# Altium schematic sheet USB charger.SchDoc
size A4
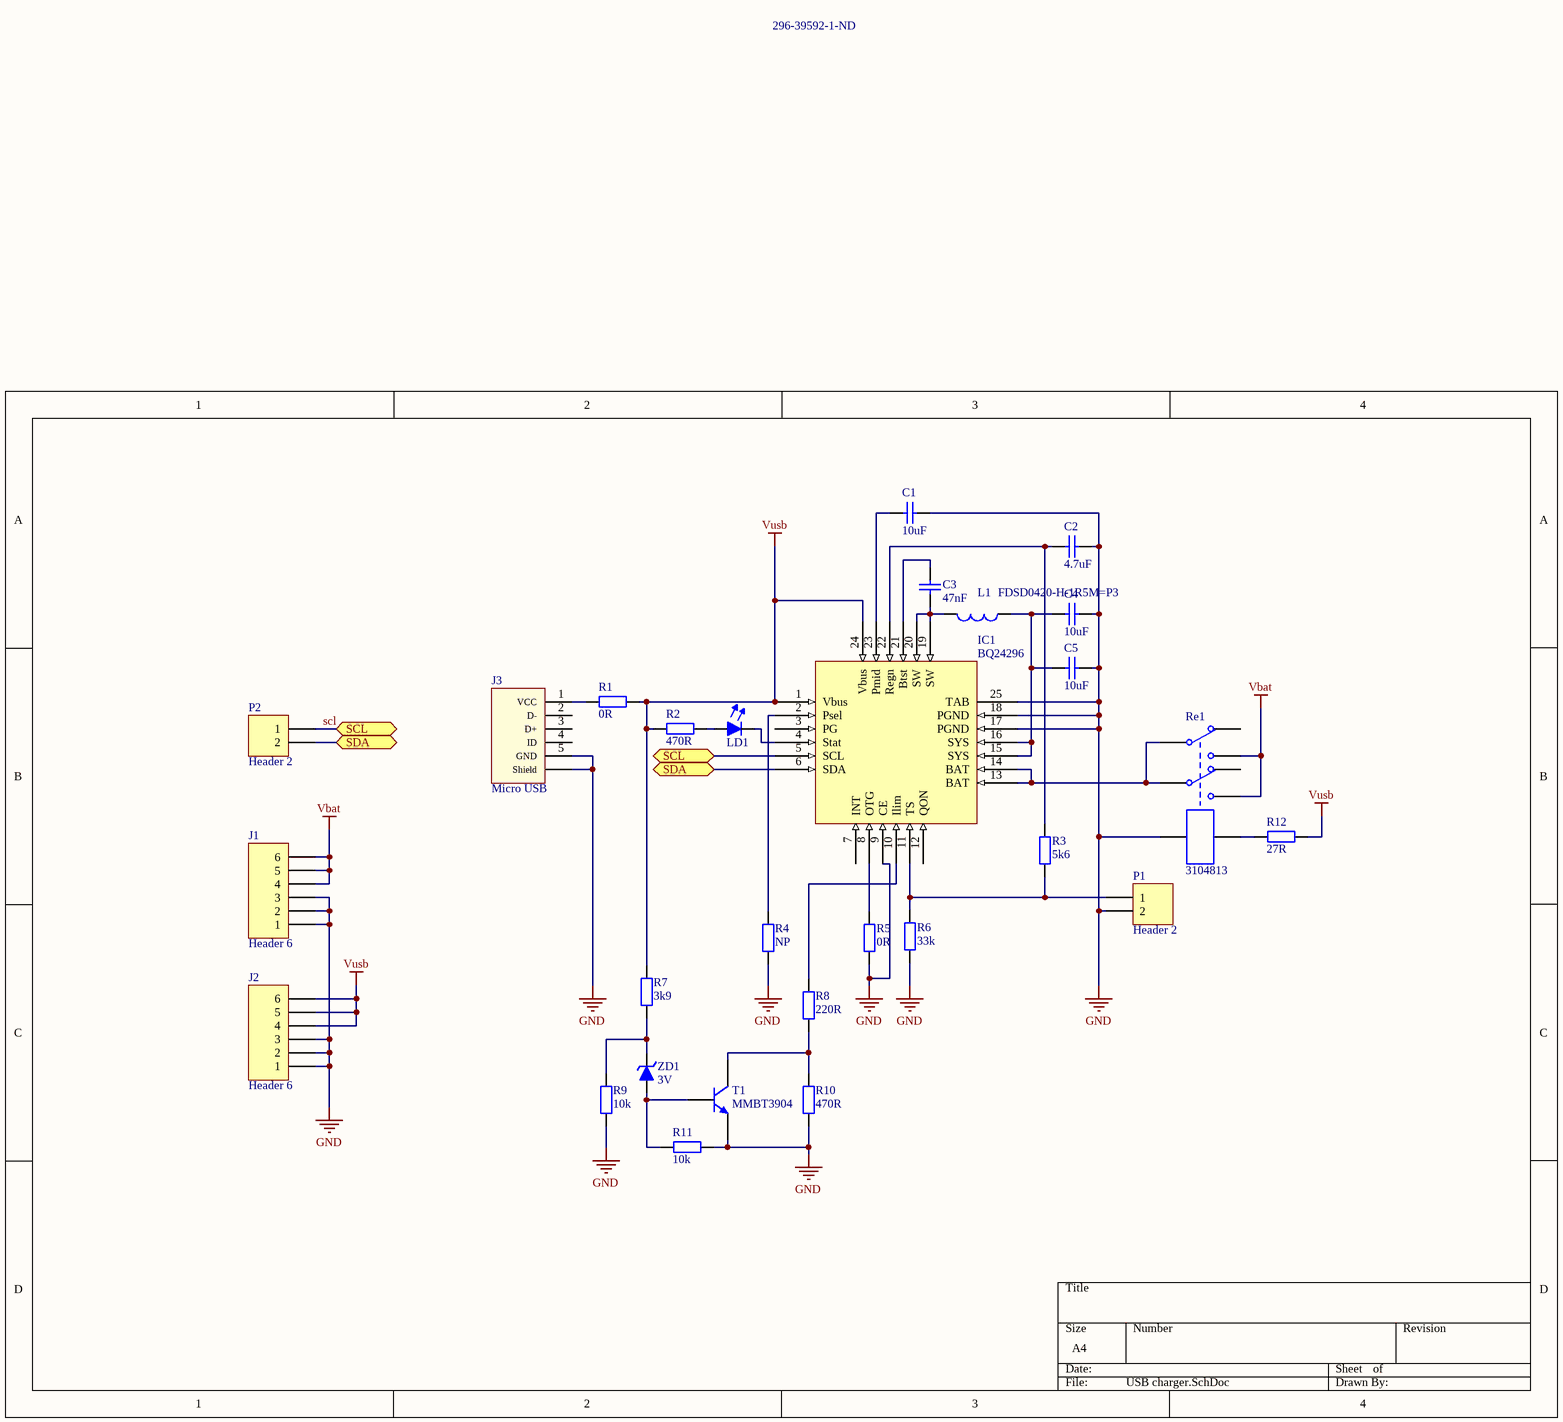
[diagram p0: USB charger.SchDoc]

## Parts
C1  value 10uF  [0805 CAP]  (hidden comment: Capacitor)
C2  value 4.7uF  [0805 CAP]  (hidden comment: Capacitor)
C3  value 47nF  [0603 cap]  (hidden comment: Capacitor)
C4  value 10uF  [0805 CAP]  (hidden comment: Capacitor)
C5  value 10uF  [0805 CAP]  (hidden comment: Capacitor)
IC1  BQ24296  Supplier Part Number 1: 296-39592-1-ND  [QFN4x4]
J1  Header 6  [HDR1X6]
J2  Header 6  [HDR1X6]
J3  Micro USB  [629105150521]
L1  value FDSD0420-H-1R5M=P3  [FDSD0420-H]  (hidden comment: Inductor FDSD0420)
LD1  LED diode  [LED_0603]  (value not drawn)
P1  Header 2  [HDR1X2]
P2  Header 2  [HDR1X2]
R1  value 0R  [0805 RES]  (hidden comment: Resistor generic)
R2  value 470R  [0603 RES]  (hidden comment: Resistor generic)
R3  value 5k6  [0603 RES]  (hidden comment: Resistor generic)
R4  value NP  [0603 RES]  (hidden comment: Resistor generic)
R5  value 0R  [0603 RES]  (hidden comment: Resistor generic)
R6  value 33k  [0603 RES]  (hidden comment: Resistor generic)
R7  value 3k9  [0603 RES]  (hidden comment: Resistor generic)
R8  value 220R  [0603 RES]  (hidden comment: Resistor generic)
R9  value 10k  [0603 RES]  (hidden comment: Resistor generic)
R10  value 470R  [0603 RES]  (hidden comment: Resistor generic)
R11  value 10k  [0603 RES]  (hidden comment: Resistor generic)
R12  value 27R  [0603 RES]  (hidden comment: Resistor generic)
Re1  Supplier Part Number 1: 3104813  [Relay AGQ2004H]  (hidden comment: Relay dual)
T1  MMBT3904  [BC857]
ZD1  value 3V  [SOD323]  (hidden comment: Diode Zener)

## Ports
SCL, SDA

## Nets
GND: C1.2 C2.1 C4.2 C5.2 IC1.9(CE) IC1.17(PGND) IC1.18(PGND) IC1.25(TAB) J1.1 J1.2 J1.3 J2.1 J2.2 J2.3 J3.5(GND) J3.Shell(Shield) P1.2 R4.1 R5.1 R6.1 R9.2 R10.1 R11.1 Re1.1(C1) T1.3(E)
Vbat: J1.4 J1.5 J1.6 Re1.4(NO1) Re1.7(NO2)
Vusb: IC1.1(Vbus) IC1.24(Vbus) J2.4 J2.5 J2.6 R1.2 R2.2 R7.1 R12.2
scl: IC1.5(SCL) P2.1 ; port SCL
SDA: IC1.6(SDA) P2.2 ; port SDA
NetC1_1: C1.1 IC1.23(Pmid)
NetC2_2: C2.2 IC1.22(Regn) R3.1
NetC3_1: C3.1 IC1.19(SW) IC1.20(SW) L1.2
NetC3_2: C3.2 IC1.21(Btst)
NetC4_1: C4.1 C5.1 IC1.15(SYS) IC1.16(SYS) L1.1
NetIC1_2: IC1.2(Psel) R4.2
NetIC1_4: IC1.4(Stat) LD1.2(K)
NetIC1_8: IC1.8(OTG) R5.2
NetIC1_10: IC1.10(Ilim) R8.2
NetIC1_11: IC1.11(TS) P1.1 R3.2 R6.2
NetIC1_13: IC1.13(BAT) IC1.14(BAT) Re1.3(COM1) Re1.6(COM2)
NetJ3_1: J3.1(VCC) R1.1
NetLD1_1: LD1.1(A1) R2.1
NetR7_2: R7.2 R9.1 ZD1.2(K)
NetR8_1: R8.1 R10.2 T1.2(C)
NetR11_2: R11.2 T1.1(B) ZD1.1(A)
NetR12_1: R12.1 Re1.2(C2)

Not connected (* = marked no-connect by the designer): IC1 3(PG) 7(INT) 12(QON); J3 2(D-) 3(D+) 4(ID); Re1 5(NC1) 8(NC2)

## Library data of the parts
C1-C5 = Capacitor NP: Voltage: 10V
IC1 = BQ24296: Battery charger; Uin: 4,5-6 VDC; Uout: 5 V; Iout max: 2 A; Value: BQ24296; Supplier 1: Digikey
J1 J2 = Header 6: Header, 6-Pin; LatestRevisionDate: 17-Jul-2002; LatestRevisionNote: Re-released for DXP Platform.; Publisher: Altium Limited
J3 = 629105150521: Micro USB 2.0 SMT Type B Horizontal 5 Contacts High Current WR-COM; Interface Type: Type B; Gender: Receptacle; ComponentLink1Description: Manufacturer; ComponentLink1URL: http://www.we-online.de; ComponentLink2Description: Datasheet; ComponentLink2URL: http://katalog.we-online.de/em/datasheet/629105150521.pdf; Part Number: 629105150521; Published Date: April 2017; Publisher: Wurth Elektronik; Sub-Family: Micro USB 2.0; Type: Horizontal; Construction: SMT
L1 = Inductor: Single coil; Current: *; Supplier 1: Farnell; Supplier Part Number 1: 2530091
LD1 = LED diode: LED; Value: Red
P1 P2 = Header 2: Header, 2-Pin; LatestRevisionDate: 17-Jul-2002; LatestRevisionNote: Re-released for DXP Platform.; Publisher: Altium Limited
R1-R12 = Resistor: Resistor SMD
Re1 = Relay dual: Farnell 3104813; Value: AGQ2004H; Voltage: *; Contact current: *; Supplier 1: Farnell
T1 = TR-NPN-PS: pin to pad: 1>3 2>1 3>2; Value: MMBT3904
ZD1 = Diode Zener: Zener